# EAGLE design DRV10987 (EAGLE 8.7.1)
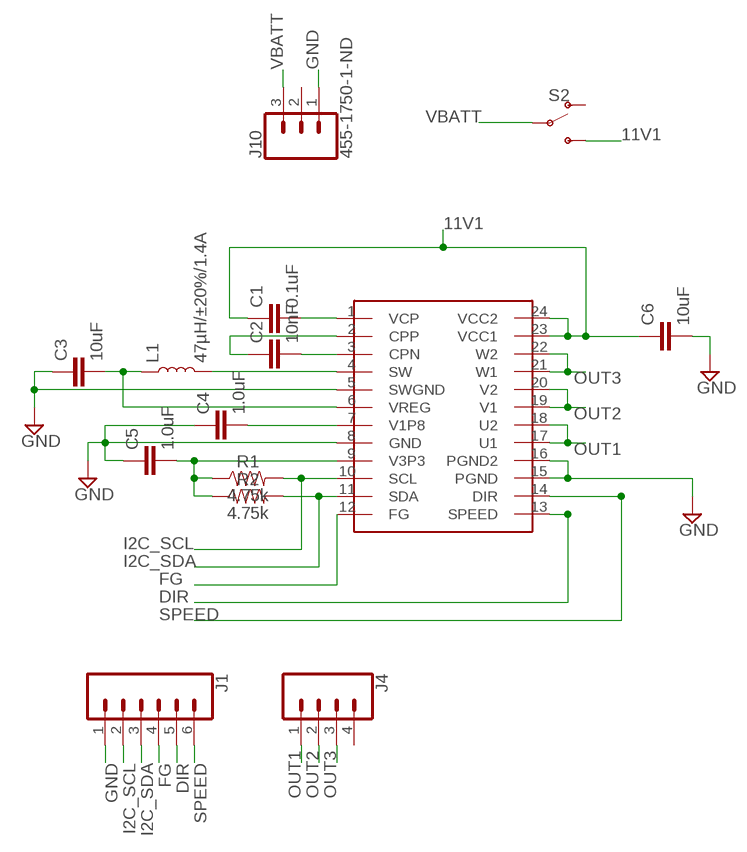
[diagram p0: schematic, sheet 1]

## Parts
C1  0.1uF  1.0UF-0805-25V-10%  [0805]
C2  10nF  1.0UF-0805-25V-10%  [0805]
C3  10uF  1.0UF-0805-25V-10%  [0805]
C4  1.0uF  1.0UF-0805-25V-10%  [0805]
C5  1.0uF  1.0UF-0805-25V-10%  [0805]
C6  10uF  1.0UF-0805-25V-10%  [0805]
J1  CONN_06LOCK  [1X06_LOCK]
J4  CONN_04  [1X04]
J10  455-1750-1-ND  CONN_03  [1X03]
L1  47µH/±20%/1.4A  INDUCTOR-SRN6045-33UH  [SRN6045]
R1  4.75k  RESISTOR0805  [0805]
R2  4.75k  RESISTOR0805  [0805]
S2  SWITCH-SPDT-PTH-11.6X4.0MM  [SWITCH_SPDT_PTH_11.6X4.0MM]
U$1  DRV10987  [DRV10987]

## Nets
11V1: C1.1 C6.1 S2.3(S) U$1.23(VCC1) U$1.24(VCC2)
DIR: J1.5 U$1.13(SPEED)
FG: J1.4 U$1.12(FG)
GND: C3.1 C4.1 C5.1 C6.2 J1.1 J10.1 U$1.5(SWGND) U$1.8(GND) U$1.15(PGND) U$1.16(PGND2)
I2C_SCL: J1.2 R1.2 U$1.10(SCL)
I2C_SDA: J1.3 R2.2 U$1.11(SDA)
N$1: C1.2 U$1.1(VCP)
N$2: C2.1 U$1.2(CPP)
N$3: C2.2 U$1.3(CPN)
N$4: L1.2 U$1.4(SW)
N$6: C3.2 L1.1 U$1.6(VREG)
N$7: C4.2 U$1.7(V1P8)
N$9: C5.2 R1.1 R2.1 U$1.9(V3P3)
OUT1: J4.1 U$1.17(U1) U$1.18(U2)
OUT2: J4.2 U$1.19(V1) U$1.20(V2)
OUT3: J4.3 U$1.21(W1) U$1.22(W2)
SPEED: J1.6 U$1.14(DIR)
VBATT: J10.3 S2.2(P)
Unconnected: J4.4 J10.2 S2.1(O)

## Library data of the parts
C1-C3 C6 = SparkFun-Capacitors:1.0UF: 1µF ceramic capacitors A capacitor is a passive two-terminal electrical component used to store electrical energy temporarily in an electric field.; PROD_ID: CAP-08064; VALUE: 1.0uF
C4 C5 = SparkFun-Capacitors:1.0UF: 1µF ceramic capacitors A capacitor is a passive two-terminal electrical component used to store electrical energy temporarily in an electric field.; PROD_ID: CAP-08064
J1 = SparkFun-Connectors:CONN_06: Multi connection point. Often used as Generic Header-pin footprint for 0.1 inch spaced/style header connections On any of the 0.1 inch spaced packages, you can populate with these: Break Away Headers - Straight <https://www.sparkfun.com/products/116> (PRT-00116) Break Away Male Headers - Right Angle <https://www.sparkfun.com/products/553> (PRT-00553) Female Headers <https://www.sparkfun.com/products/115> (PRT-00115) Break Away Headers - Machine Pin <https://www.sparkfun.com/products/117> (PRT-00117) Break Away Female Headers - Swiss Machine Pin <https://www.sparkfun.com/products/743> (PRT-00743) Arduino Stackable Header - 6 Pin <https://www.sparkfun.com/products/9280> (PRT-09280) For SCREWTERMINALS and SPRING TERMINALS visit here: Screw Terimnals on SparkFun.com <https://www.sparkfun.com/search/results?term=Screw+Terminals> (5mm/3.5mm/2.54mm spacing) This device is also useful as a general connection point to wire up your design to another part of your project. Our various solder wires solder well into these plated through hole pads. Hook-Up Wire - Assortment (Stranded, 22 AWG) <https://www.sparkfun.com/products/11375> (PRT-11375) Hook-Up Wire - Assortment (Solid Core, 22 AWG) <https://www.sparkfun.com/products/11367> (PRT-11367) View the entire wire category on our website here <https://www.sparkfun.com/categories/141>
J4 = SparkFun-Connectors:CONN_04: Multi connection point. Often used as Generic Header-pin footprint for 0.1 inch spaced/style header connections On any of the 0.1 inch spaced packages, you can populate with these: Break Away Headers - Straight <https://www.sparkfun.com/products/116> (PRT-00116) Break Away Male Headers - Right Angle <https://www.sparkfun.com/products/553> (PRT-00553) Female Headers <https://www.sparkfun.com/products/115> (PRT-00115) Break Away Headers - Machine Pin <https://www.sparkfun.com/products/117> (PRT-00117) Break Away Female Headers - Swiss Machine Pin <https://www.sparkfun.com/products/743> (PRT-00743) For SCREWTERMINALS and SPRING TERMINALS visit here: Screw Terimnals on SparkFun.com <https://www.sparkfun.com/search/results?term=Screw+Terminals> (5mm/3.5mm/2.54mm spacing) This device is also useful as a general connection point to wire up your design to another part of your project. Our various solder wires solder well into these plated through hole pads. Hook-Up Wire - Assortment (Stranded, 22 AWG) <https://www.sparkfun.com/products/11375> (PRT-11375) Hook-Up Wire - Assortment (Solid Core, 22 AWG) <https://www.sparkfun.com/products/11367> (PRT-11367) View the entire wire category on our website here <https://www.sparkfun.com/categories/141> Special notes: Molex polarized connector foot print use with SKU : PRT-08231 with associated crimp pins and housings. 1MM SMD Version SKU: PRT-10208; PROD_ID: CONN-09696
J10 = SparkFun-Connectors:CONN_03: Multi connection point. Often used as Generic Header-pin footprint for 0.1 inch spaced/style header connections On any of the 0.1 inch spaced packages, you can populate with these: Break Away Headers - Straight <https://www.sparkfun.com/products/116> (PRT-00116) Break Away Male Headers - Right Angle <https://www.sparkfun.com/products/553> (PRT-00553) Female Headers <https://www.sparkfun.com/products/115> (PRT-00115) Break Away Headers - Machine Pin <https://www.sparkfun.com/products/117> (PRT-00117) Break Away Female Headers - Swiss Machine Pin <https://www.sparkfun.com/products/743> (PRT-00743) Stackable Header - 3 Pin (Female, 0.1") <https://www.sparkfun.com/products/13875> (PRT-13875) For SCREWTERMINALS and SPRING TERMINALS visit here: Screw Terimnals on SparkFun.com <https://www.sparkfun.com/search/results?term=Screw+Terminals> (5mm/3.5mm/2.54mm spacing) This device is also useful as a general connection point to wire up your design to another part of your project. Our various solder wires solder well into these plated through hole pads. Hook-Up Wire - Assortment (Stranded, 22 AWG) <https://www.sparkfun.com/products/11375> (PRT-11375) Hook-Up Wire - Assortment (Solid Core, 22 AWG) <https://www.sparkfun.com/products/11367> (PRT-11367) View the entire wire category on our website here <https://www.sparkfun.com/categories/141> Special notes: Molex polarized connector foot print use with SKU : PRT-08232 with associated crimp pins and housings.; PROD_ID: XXX-00000
L1 = SparkFun-Coils:INDUCTOR: Inductors Resist changes in electrical current. Basically a coil of wire. SparkFun Products: SparkFun Load Cell Amplifier - HX711 <https://www.sparkfun.com/products/13879> IOIO-OTG - V2.2 <https://www.sparkfun.com/products/13613>; PROD_ID: NDUC-11627; VALUE: 33µH/±20%/1.4A
R1 R2 = SparkFun-Resistors:RESISTOR: Generic Resistor Package
S2 = SparkFun-Switches:SWITCH-SPDT: Single Pole, Double Throw (SPDT) Switch Single-pole, double-throw (SPDT) switch. Variant Overview SMD-AYZ0202 Surface Mount DPDT Switch <https://www.sparkfun.com/products/597> (COM-00597) Used on e.g. LilyPad Arduino USB - ATmega32U4 Board <https://www.sparkfun.com/products/12049> PTH-11.6X4.0MM SPDT Mini Power Switch <https://www.sparkfun.com/products/102> (COM-00102) Used on e.g. SparkFun Simon Says - Through-Hole Soldering Kit <https://www.sparkfun.com/products/10547> (KIT-10547) PTH-11.6X4.0MM-KIT KIT version of SPDT Mini Power Switch - Simplifies soldering by removing tStop of switch pins - only one side can be soldered. PTH-11.6X4.0MM-LOCK LOCK version of SPDT Mini Power Switch - Offset pins hold switch in place for easier soldering. SMD-RIGHT-ANGLE Surface Mount Right Angle Switch <https://www.sparkfun.com/products/10860> (COM-10860) Used on e.g. SparkFun ESP8266 Thing <https://www.sparkfun.com/products/13231>; PROD_ID: SWCH-08261; SF_SKU: COM-00102
U$1 = BLDC_DRIVER:DRV10987

## Board
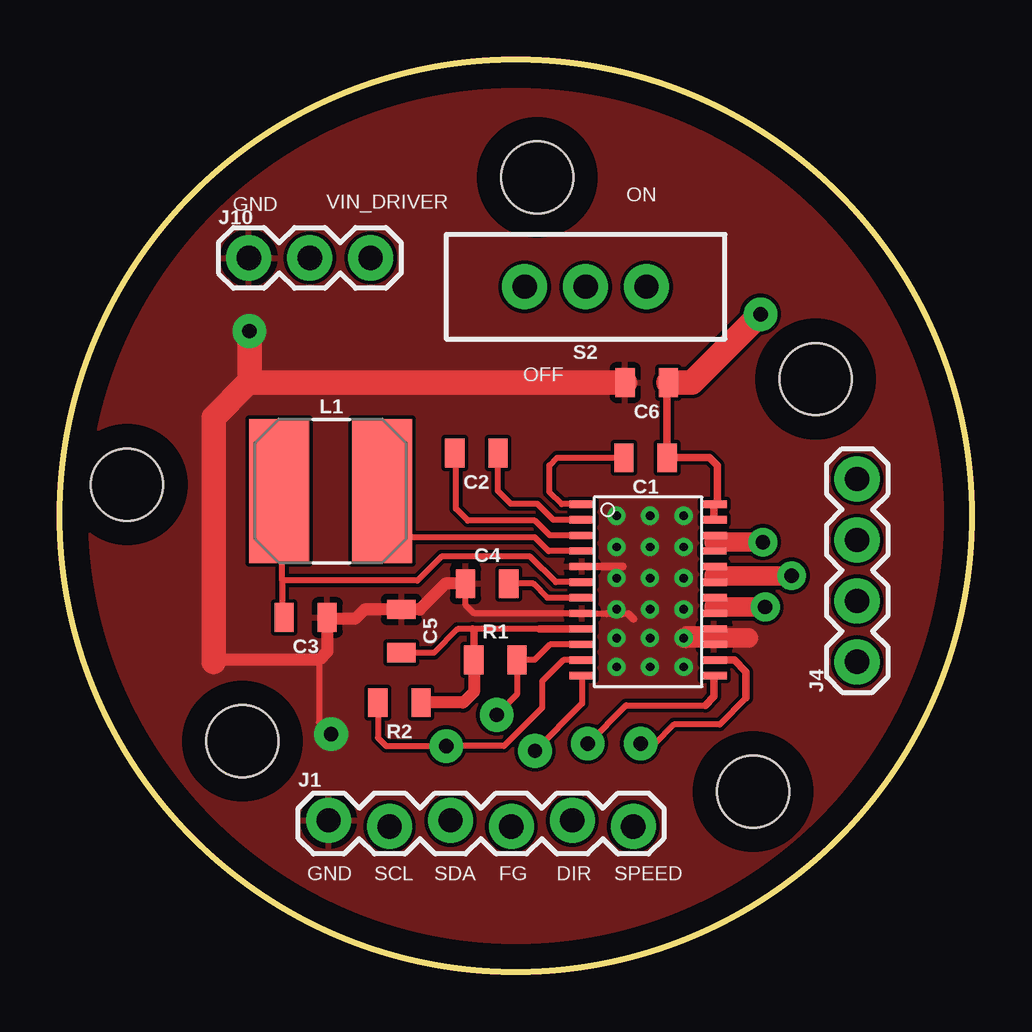
[diagram p1: board, top side]
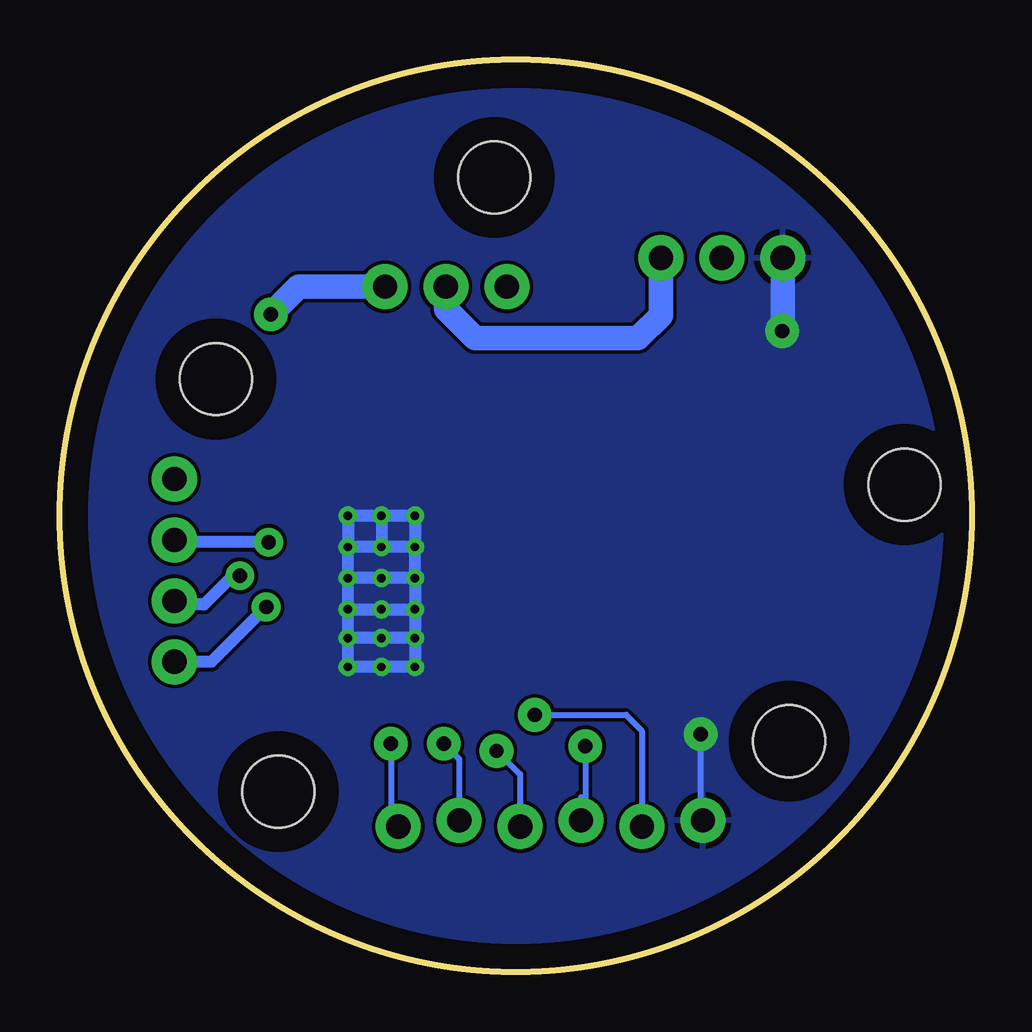
[diagram p2: board, bottom side, seen from below]

Size 38 x 38 mm. Coordinates in mm from the lower left corner, seen from the top.
Outline: circle at 19,19 radius 19
Copper layers (1*16): Top 0.035mm / dielectric 1.5mm / Bottom 0.035mm
Design rules "default": minimum track width 6mil, minimum drill 0.35mm, track to track 6mil, track to pad 6mil, pad to pad 6mil, via to via 6mil, smd to smd 6mil, copper to edge 40mil, drill to drill 6mil, minimum pad ring 10mil, minimum via ring 8mil, stop-mask expansion 4mil, vias tented up to drill 0mil, thermal gap 10mil
Holes 3 mm at 28.9,7.5 31.5,24.7 2.8,20.3 19.9,33.1 7.6,9.6

### Footprints (pad centres in the part's own frame; a part is rotated, then mirrored left to right if it is on the bottom)
0805 = smd 0.8 x 1.2: 1 -0.9,0; 2 0.9,0
1X06_LOCK = drill 1.016 pad 1.88: 1 0,0; 2 2.54,-0.254; 3 5.08,0; 4 7.62,-0.254; 5 10.16,0; 6 12.7,-0.254
1X04 = drill 1.016 pad 1.88: 1 0,0; 2 2.54,0; 3 5.08,0; 4 7.62,0
1X03 = drill 1.016 pad 1.88: 1 0,0; 2 2.54,0; 3 5.08,0
SRN6045 = smd 2.5 x 6: 1 -2.175,0; 2 2.125,0
SWITCH_SPDT_PTH_11.6X4.0MM = drill 1.016 pad 1.88: 1 0,2.54; 2 0,0; 3 0,-2.54
DRV10987 = smd 0.3 x 1.05: 1 0.3,-0.5; 2 0.95,-0.5; 3 1.6,-0.5; 4 2.25,-0.5; 5 2.9,-0.5; 6 3.55,-0.5; 7 4.2,-0.5; 8 4.85,-0.5; 9 5.5,-0.5; 10 6.15,-0.5; 11 6.8,-0.5; 12 7.45,-0.5; 13 7.45,5; 14 6.8,5; 15 6.15,5; 16 5.5,5; 17 4.85,5; 18 4.2,5; 19 3.55,5; 20 2.9,5; 21 2.25,4.98; 22 1.6,5; 23 0.95,5; 24 0.3,5

### Placement (x,y rotation side)
C1  24.41,21.42 180 top
C2  17.36,21.61 180 top
C3  10.24,14.76 180 top
C4  17.81,16.17 0 top
C5  14.23,14.19 270 top
C6  24.46,24.55 180 top
J1  11.2,6.3 0 top
J4  33.23,12.91 90 top
J10  7.87,29.75 0 top
L1  11.31,20.04 0 top
R1  18.15,12.99 0 top
R2  14.15,11.21 180 top
S2  21.91,28.55 90 top
U$1  22.27,19.78 270 top

### Tracks (layer width: path | path; a pad name or v marks a point on that pad's centre or on a via)
11V1  (via drill 0.6 pad 1.4)
  Top 0.305: U$1.23 U$1.24 27.4,19.61 27.4,21.1 27.08,21.42 C1.1 25.31,24.5 C6.1
  Top 1.016: v29.2,27.4 26.35,24.55 C6.1
  Bottom 1.016: S2.3 28.05,28.55 v29.2,27.4
DIR  (via drill 0.6 pad 1.4)
  Top 0.254: v22,9.5 23.6,11.1 26.9,11.1
  Top 0.305: 26.9,11.1 27.27,11.47 U$1.13
  Bottom 0.254: v22,9.5 21.36,8.86 J1.5
FG  (via drill 0.6 pad 1.4)
  Top 0.254: U$1.12 21.77,11.17 v19.8,9.2
  Top 0.305: 21.77,12.3 U$1.12
  Bottom 0.254: v19.8,9.2 18.82,8.22 J1.4
GND  (via drill 0.35, 0.6 pad 1.4)
  Top 0.254: 23.69,14.9 23.4,14.9 22.8,14.9 22.77,14.93 U$1.8 17.27,14.93 16.91,15.29 C4.1 | U$1.15 26.13,13.63 | 26.13,13.63 26.1,13.6 | 26.13,13.63 26.2,13.7 | 26.07,14.28 U$1.16 | 10.8,13 10.8,10.4 v11.3,9.9
  Top 0.305: 23.9,14.69 23.69,14.9 | 23.3,15 23.4,14.9 | U$1.5 23.47,16.88
  Top 0.508: 6.4,12.9 6.5,13 10.8,13 11.14,13.34 C3.1 11.2,14.7 12.3,14.7 12.69,15.09 C5.1 14.99,15.09 16.07,16.17 C4.1
  Top 0.813: v26,13.9 28.5,13.9 28.7,13.9
  Top 1.016: C6.2 7.85,24.55 | 7.85,24.55 6.4,23.1 6.4,12.9 | v7.9,26.7 7.9,24.6 7.85,24.55
  Bottom 0.254: v11.3,9.9 11.3,6.4 J1.1
  Bottom 0.508: v24.6,19 v23.2,19 v23.2,17.7 | v24.6,19 v26,19 v26,17.7 | v23.2,17.7 v24.6,17.7 | v24.6,17.7 v26,17.7 | v24.6,19 v24.6,17.7 | v23.2,16.4 v23.2,17.7 | v23.2,16.4 v23.2,15.1 | v23.2,15.1 v23.2,13.9 | v23.2,13.9 v23.2,12.7 v24.6,12.7 v26,12.7 v26,13.9 | v26,13.9 v26,15.1 | v26,15.1 v26,16.4 | v26,16.4 v26,17.7 | v23.2,16.4 v24.6,16.4 v26,16.4 | v26,15.1 v24.6,15.1 v23.2,15.1 | v23.2,13.9 v24.6,13.9 v26,13.9
  Bottom 1.016: J10.1 7.87,27.23 v7.9,26.7
  pour Bottom: 0.1,18.9 0.5,23 2.2,28 5.6,32.5 10.1,35.7 15.2,37.5 21.2,37.9 28.3,35.4 33,31.9 36.1,27.2 37.7,22 37.8,15.7 35.7,9.9 33.6,6.7 30.6,4.1 26.9,1.8 22.2,0.4 17.2,0.2 12.7,1.2 9,2.9 5.9,5.4 3.3,8.5 1.4,12 0.3,15.8
  pour Top: 0.1,18.8 0.5,23 1.8,26.9 3.7,30.2 6.9,33.6 11.5,36.4 16.5,37.8 21.2,37.8 25.6,36.6 29.9,34.5 33.3,31.6 35.9,27.6 37.5,23.4 38,18.7 37.2,13.5 35.3,9.2 32.8,6.1 29.6,3.2 25.2,1 20.2,0.2 15,0.5 11,1.7 7,4.3 4.2,7.1 2.1,10.6 0.4,15.3
I2C_SCL  (via drill 0.6 pad 1.4)
  Top 0.254: U$1.10 20.43,13.63 19.79,12.99 R1.2 19.05,11.55 v18.2,10.7
  Bottom 0.254: J1.2 13.74,10.04 14.4,10.7 v18.2,10.7
I2C_SDA  (via drill 0.6 pad 1.4)
  Top 0.254: U$1.11 20.98,12.98 20.1,12.1 20.1,11 18.5,9.4 v16.1,9.4 13.6,9.4 13.25,9.75 R2.2
  Bottom 0.254: 16.28,7.28 J1.3 16.1,6.48 v16.1,9.4
N$1
  Top 0.254: U$1.1 20.92,19.48 20.4,20 20.4,21.1 20.72,21.42 C1.2
N$2
  Top 0.254: U$1.2 20.57,18.83 19.9,19.5 18.8,19.5 18.26,20.04 C2.1
N$3
  Top 0.254: U$1.3 20.42,18.18 19.8,18.8 17,18.8 16.5,19.3 16.5,21.57 C2.2
N$4
  Top 0.254: U$1.4 20.37,17.53 19.8,18.1 14.1,18.1 13.7,18.5
  Top 0.305: L1.2 13.44,18.77 13.7,18.5
N$6
  Top 0.254: U$1.6 20.67,16.23 19.6,17.3 15.9,17.3 14.9,16.3 9.26,16.3 | 9.26,16.3 9.26,18.3 | 9.26,16.3 9.26,14.84 C3.2
  Top 0.305: 9.3,17.77 9.26,18.3 9.17,19.6 L1.1
N$7
  Top 0.254: U$1.7 20.32,15.58 19.73,16.17 C4.2
N$9
  Top 0.254: 19.98,14.28 17.2,14.28 16.58,14.28 15.59,13.29 C5.2
  Top 0.305: U$1.9 19.98,14.28 | R1.1 17.25,14.23 17.2,14.28
  Top 0.508: R1.1 17.25,11.65 16.8,11.2 16.79,11.21 R2.1
OUT1  (via drill 0.6 pad 1.2)
  Top 0.305: U$1.17 27.27,15.2 U$1.18
  Top 0.813: 27.27,15.2 v29.4,15.2
  Bottom 0.508: v29.4,15.2 31.69,12.91 J4.1
OUT2  (via drill 0.6 pad 1.2)
  Top 0.305: U$1.19 27.27,16.5 U$1.20
  Top 0.813: 27.27,16.5 v30.5,16.5
  Bottom 0.508: v30.5,16.5 30.8,16.5 32,15.3 33.08,15.3 J4.2
OUT3  (via drill 0.6 pad 1.2)
  Top 0.305: 27.27,17.55 U$1.21 27.25,17.9 27.25,18.16 U$1.22
  Top 0.813: 27.25,17.9 v29.3,17.9
  Bottom 0.508: v29.3,17.9 33.14,17.9 J4.3
SPEED  (via drill 0.6 pad 1.4)
  Top 0.254: 28.6,11.4 27.5,10.3 25.6,10.3 24.8,9.5 v24.2,9.5
  Top 0.305: 28.6,11.4 28.6,12.5 28.12,12.98 U$1.14
  Bottom 0.254: v24.2,9.5 24.2,6.35 J1.6
VBATT
  Bottom 1.016: J10.3 12.95,27.35 13.9,26.4 20.7,26.4 21.91,27.61 S2.2

### Text on the board
tPlace: GND | VIN_DRIVER | ON | OFF | GND | SCL | SDA | FG | DIR | SPEED